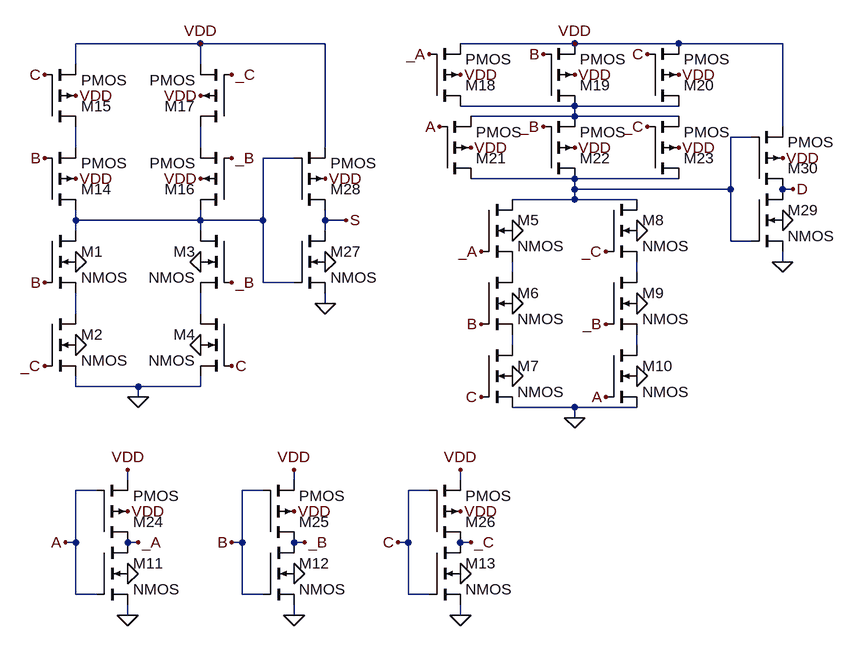
[diagram p0: schematic Encoder-v2.asc]
Encoder-v2.asc, the LTspice schematic file:
Version 4
SHEET 1 880 780
WIRE -688 -976 -880 -976
WIRE -496 -976 -688 -976
WIRE -112 -976 -288 -976
WIRE 48 -976 -112 -976
WIRE 208 -976 48 -976
WIRE -880 -944 -880 -976
WIRE -688 -944 -688 -976
WIRE -112 -880 -288 -880
WIRE 48 -880 -112 -880
WIRE -112 -864 -112 -880
WIRE -112 -864 -272 -864
WIRE 48 -864 -112 -864
WIRE 208 -848 208 -976
WIRE 160 -832 128 -832
WIRE -880 -816 -880 -848
WIRE -688 -816 -688 -848
WIRE -496 -816 -496 -976
WIRE -544 -800 -592 -800
WIRE -112 -768 -272 -768
WIRE 48 -768 -112 -768
WIRE -112 -752 -112 -768
WIRE 128 -752 128 -832
WIRE 128 -752 -112 -752
WIRE 208 -752 208 -768
WIRE 224 -752 208 -752
WIRE -112 -736 -112 -752
WIRE -112 -736 -208 -736
WIRE -16 -736 -112 -736
WIRE -880 -704 -880 -720
WIRE -688 -704 -688 -720
WIRE -688 -704 -880 -704
WIRE -592 -704 -592 -800
WIRE -592 -704 -688 -704
WIRE -496 -704 -496 -720
WIRE -464 -704 -496 -704
WIRE -880 -688 -880 -704
WIRE -688 -688 -688 -704
WIRE -496 -688 -496 -704
WIRE 128 -672 128 -752
WIRE 160 -672 128 -672
WIRE 208 -640 208 -656
WIRE -208 -624 -208 -640
WIRE -16 -624 -16 -640
WIRE -592 -608 -592 -704
WIRE -544 -608 -592 -608
WIRE -496 -576 -496 -592
WIRE -880 -560 -880 -592
WIRE -688 -560 -688 -592
WIRE -208 -512 -208 -528
WIRE -16 -512 -16 -528
WIRE -880 -448 -880 -464
WIRE -784 -448 -880 -448
WIRE -688 -448 -688 -464
WIRE -688 -448 -784 -448
WIRE -784 -432 -784 -448
WIRE -112 -416 -208 -416
WIRE -16 -416 -112 -416
WIRE -112 -400 -112 -416
WIRE -800 -304 -800 -320
WIRE -544 -304 -544 -320
WIRE -288 -304 -288 -320
WIRE -848 -288 -880 -288
WIRE -592 -288 -624 -288
WIRE -336 -288 -368 -288
WIRE -880 -208 -880 -288
WIRE -880 -208 -896 -208
WIRE -800 -208 -800 -224
WIRE -784 -208 -800 -208
WIRE -624 -208 -624 -288
WIRE -624 -208 -640 -208
WIRE -544 -208 -544 -224
WIRE -528 -208 -544 -208
WIRE -368 -208 -368 -288
WIRE -368 -208 -384 -208
WIRE -288 -208 -288 -224
WIRE -272 -208 -288 -208
WIRE -880 -128 -880 -208
WIRE -848 -128 -880 -128
WIRE -624 -128 -624 -208
WIRE -592 -128 -624 -128
WIRE -368 -128 -368 -208
WIRE -336 -128 -368 -128
WIRE -800 -96 -800 -112
WIRE -544 -96 -544 -112
WIRE -288 -96 -288 -112
FLAG -16 -464 0
FLAG -16 -576 0
FLAG -16 -688 0
FLAG -208 -688 0
FLAG -208 -576 0
FLAG -784 -432 0
FLAG -800 -160 0
FLAG -800 -96 0
FLAG -544 -96 0
FLAG -288 -96 0
FLAG -288 -160 0
FLAG -544 -160 0
FLAG -496 -640 0
FLAG -496 -576 0
FLAG -208 -464 0
FLAG -880 -640 0
FLAG -880 -512 0
FLAG -688 -512 0
FLAG -688 -640 0
FLAG -688 -976 VDD
FLAG -880 -896 VDD
FLAG -688 -896 VDD
FLAG -688 -768 VDD
FLAG -880 -768 VDD
FLAG -496 -768 VDD
FLAG -288 -928 VDD
FLAG -112 -928 VDD
FLAG 48 -928 VDD
FLAG -272 -816 VDD
FLAG -112 -816 VDD
FLAG 48 -816 VDD
FLAG -288 -256 VDD
FLAG -544 -256 VDD
FLAG -800 -256 VDD
FLAG -112 -976 VDD
FLAG -288 -320 VDD
FLAG -544 -320 VDD
FLAG -800 -320 VDD
FLAG -896 -208 A
FLAG -784 -208 _A
FLAG -640 -208 B
FLAG -528 -208 _B
FLAG -384 -208 C
FLAG -272 -208 _C
FLAG -928 -800 B
FLAG -928 -608 B
FLAG -928 -928 C
FLAG -640 -480 C
FLAG -640 -608 _B
FLAG -640 -800 _B
FLAG -928 -480 _C
FLAG -640 -928 _C
FLAG -464 -704 S
FLAG -336 -960 _A
FLAG -256 -656 _A
FLAG -160 -960 B
FLAG -256 -544 B
FLAG -256 -432 C
FLAG 0 -960 C
FLAG -320 -848 A
FLAG -64 -432 A
FLAG -160 -848 _B
FLAG -64 -544 _B
FLAG -64 -656 _C
FLAG 0 -848 _C
FLAG 208 -640 0
FLAG 208 -704 0
FLAG 208 -800 VDD
FLAG 224 -752 D
FLAG -112 -400 0
SYMBOL nmos4 -928 -688 R0
SYMATTR InstName M1
SYMBOL nmos4 -928 -560 R0
SYMATTR InstName M2
SYMBOL nmos4 -640 -688 M0
SYMATTR InstName M3
SYMBOL nmos4 -640 -560 M0
SYMATTR InstName M4
SYMBOL nmos4 -256 -736 R0
SYMATTR InstName M5
SYMBOL nmos4 -256 -624 R0
SYMATTR InstName M6
SYMBOL nmos4 -256 -512 R0
SYMATTR InstName M7
SYMBOL nmos4 -64 -736 R0
SYMATTR InstName M8
SYMBOL nmos4 -64 -624 R0
SYMATTR InstName M9
SYMBOL nmos4 -64 -512 R0
SYMATTR InstName M10
SYMBOL nmos4 -848 -208 R0
SYMATTR InstName M11
SYMBOL nmos4 -592 -208 R0
SYMATTR InstName M12
SYMBOL nmos4 -336 -208 R0
SYMATTR InstName M13
SYMBOL pmos4 -928 -720 M180
SYMATTR InstName M14
SYMBOL pmos4 -928 -848 M180
SYMATTR InstName M15
SYMBOL pmos4 -640 -720 R180
SYMATTR InstName M16
SYMBOL pmos4 -640 -848 R180
SYMATTR InstName M17
SYMBOL pmos4 -336 -880 M180
SYMATTR InstName M18
SYMBOL pmos4 -160 -880 M180
SYMATTR InstName M19
SYMBOL pmos4 0 -880 M180
SYMATTR InstName M20
SYMBOL pmos4 -320 -768 M180
SYMATTR InstName M21
SYMBOL pmos4 -160 -768 M180
SYMATTR InstName M22
SYMBOL pmos4 0 -768 M180
SYMATTR InstName M23
SYMBOL pmos4 -848 -208 M180
SYMATTR InstName M24
SYMBOL pmos4 -592 -208 M180
SYMATTR InstName M25
SYMBOL pmos4 -336 -208 M180
SYMATTR InstName M26
SYMBOL nmos4 -544 -688 R0
SYMATTR InstName M27
SYMBOL pmos4 -544 -720 M180
SYMATTR InstName M28
SYMBOL nmos4 160 -752 R0
SYMATTR InstName M29
SYMBOL pmos4 160 -752 M180
SYMATTR InstName M30

The netlist it stands for:
* Encoder-v2.asc
M1 N005 B N008 0 NMOS
M2 N008 _C 0 0 NMOS
M3 N005 _B N009 0 NMOS
M4 N009 C 0 0 NMOS
M5 N002 _A N006 0 NMOS
M6 N006 B N010 0 NMOS
M7 N010 C 0 0 NMOS
M8 N002 _C N007 0 NMOS
M9 N007 _B N011 0 NMOS
M10 N011 A 0 0 NMOS
M11 _A A 0 0 NMOS
M12 _B B 0 0 NMOS
M13 _C C 0 0 NMOS
M14 N005 B N003 VDD PMOS
M15 N003 C VDD VDD PMOS
M16 N005 _B N004 VDD PMOS
M17 N004 _C VDD VDD PMOS
M18 N001 _A VDD VDD PMOS
M19 N001 B VDD VDD PMOS
M20 N001 C VDD VDD PMOS
M21 N002 A N001 VDD PMOS
M22 N002 _B N001 VDD PMOS
M23 N002 _C N001 VDD PMOS
M24 _A A VDD VDD PMOS
M25 _B B VDD VDD PMOS
M26 _C C VDD VDD PMOS
M27 S N005 0 0 NMOS
M28 S N005 VDD VDD PMOS
M29 D N002 0 0 NMOS
M30 D N002 VDD VDD PMOS
.model NMOS NMOS
.model PMOS PMOS
.lib standard.mos
.backanno
.end